# EAGLE design 20-pin (EAGLE 9.6.2)
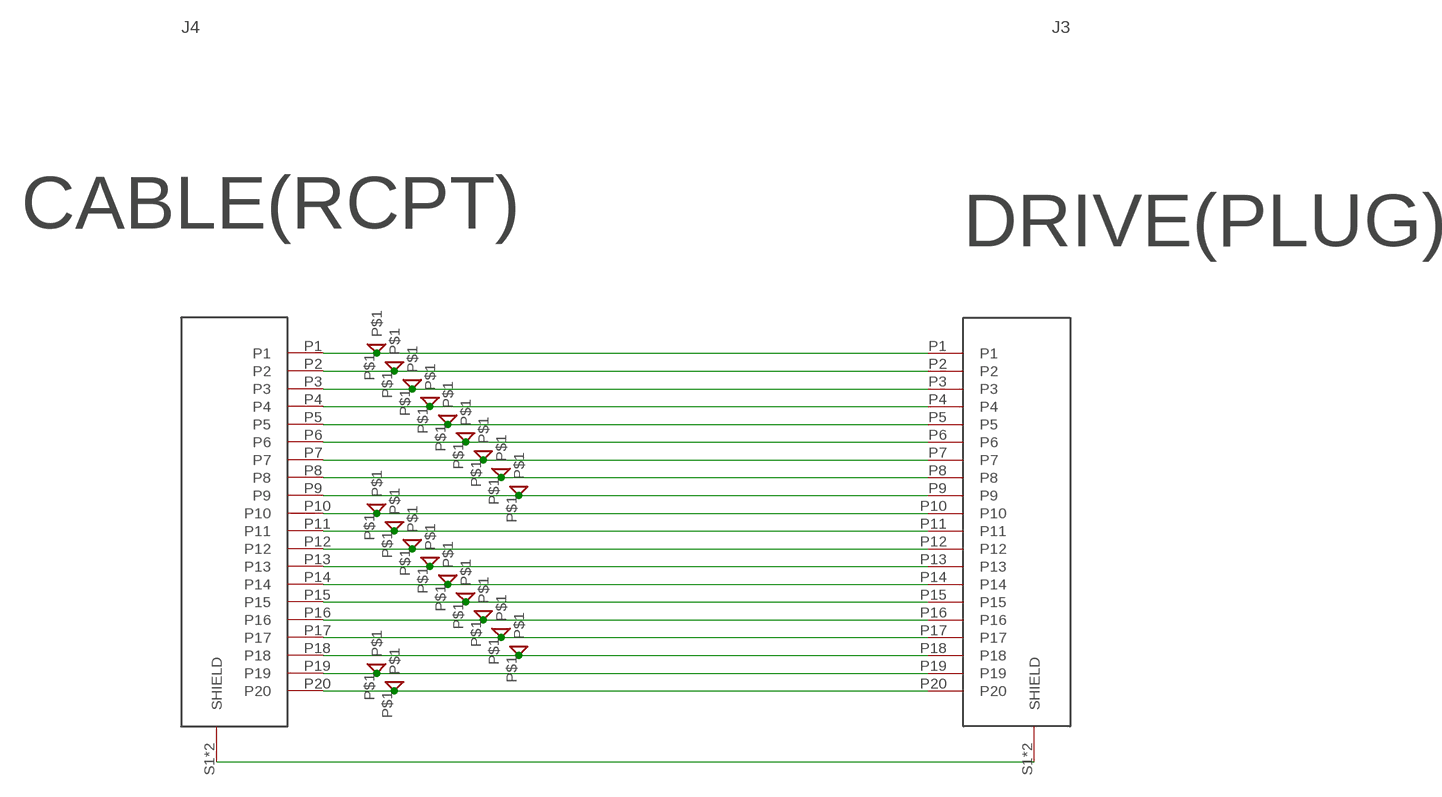
[diagram p0: schematic, sheet 1]

## Parts
J3  3M_10120-52E2PC(PLUG)  [3M_10120-52E2PC(PLUG)]
J4  3M_10220-55H3PC(RECEPTACLE)  [3M_10220-55H3PC(RECEPTACLE)]
U$1  PTH_SMALL  [PTH_SMALL]
U$2  PTH_SMALL  [PTH_SMALL]
U$3  PTH_SMALL  [PTH_SMALL]
U$4  PTH_SMALL  [PTH_SMALL]
U$5  PTH_SMALL  [PTH_SMALL]
U$6  PTH_SMALL  [PTH_SMALL]
U$7  PTH_SMALL  [PTH_SMALL]
U$8  PTH_SMALL  [PTH_SMALL]
U$9  PTH_SMALL  [PTH_SMALL]
U$10  PTH_SMALL  [PTH_SMALL]
U$11  PTH_SMALL  [PTH_SMALL]
U$12  PTH_SMALL  [PTH_SMALL]
U$13  PTH_SMALL  [PTH_SMALL]
U$14  PTH_SMALL  [PTH_SMALL]
U$15  PTH_SMALL  [PTH_SMALL]
U$16  PTH_SMALL  [PTH_SMALL]
U$17  PTH_SMALL  [PTH_SMALL]
U$18  PTH_SMALL  [PTH_SMALL]
U$19  PTH_SMALL  [PTH_SMALL]
U$20  PTH_SMALL  [PTH_SMALL]

## Nets
N$1: J3.P1 J4.P1 U$1.P$1
N$2: J3.P2 J4.P2 U$2.P$1
N$3: J3.P3 J4.P3 U$3.P$1
N$4: J3.P4 J4.P4 U$4.P$1
N$5: J3.P5 J4.P5 U$5.P$1
N$6: J3.P6 J4.P6 U$6.P$1
N$7: J3.P7 J4.P7 U$7.P$1
N$8: J3.P8 J4.P8 U$8.P$1
N$9: J3.P9 J4.P9 U$9.P$1
N$10: J3.P10 J4.P10 U$10.P$1
N$11: J3.P11 J4.P11 U$11.P$1
N$12: J3.P12 J4.P12 U$12.P$1
N$13: J3.P13 J4.P13 U$13.P$1
N$14: J3.P14 J4.P14 U$14.P$1
N$15: J3.P15 J4.P15 U$15.P$1
N$16: J3.P16 J4.P16 U$16.P$1
N$17: J3.P17 J4.P17 U$17.P$1
N$18: J3.P18 J4.P18 U$18.P$1
N$19: J3.P19 J4.P19 U$19.P$1
N$20: J3.P20 J4.P20 U$20.P$1
SHIELD: J3.S1(SHIELD) J3.S2(SHIELD) J4.S1(SHIELD) J4.S2(SHIELD)

## Notes on the sheet
- CABLE(RCPT) | DRIVE(PLUG)

## Library data of the parts
J3 = mini-d-sub:3M_10120-52E2PC(PLUG)
J4 = mini-d-sub:3M_10220-55H3PC(RECEPTACLE)
U$1-U$20 = testpoint:PTH_SMALL

## Board
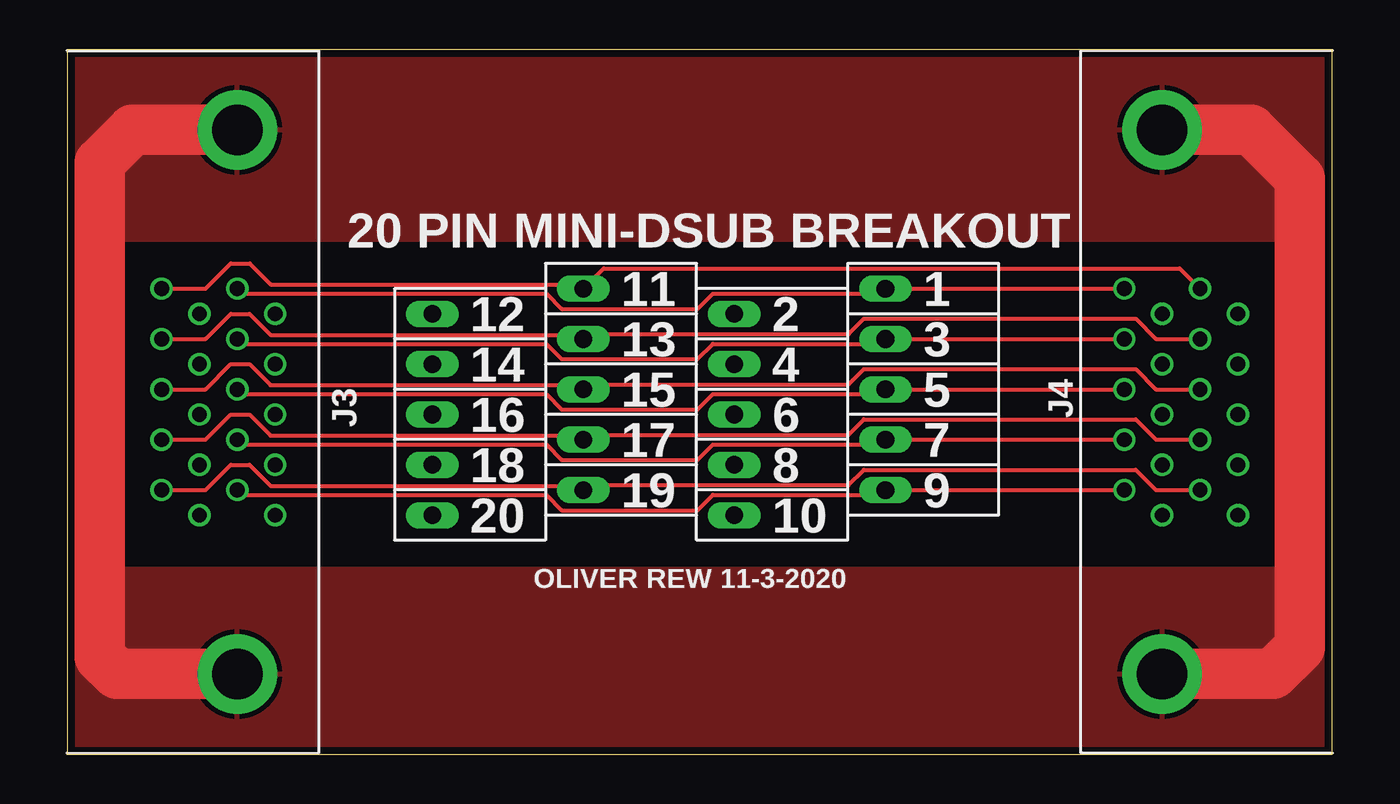
[diagram p1: board, top side]
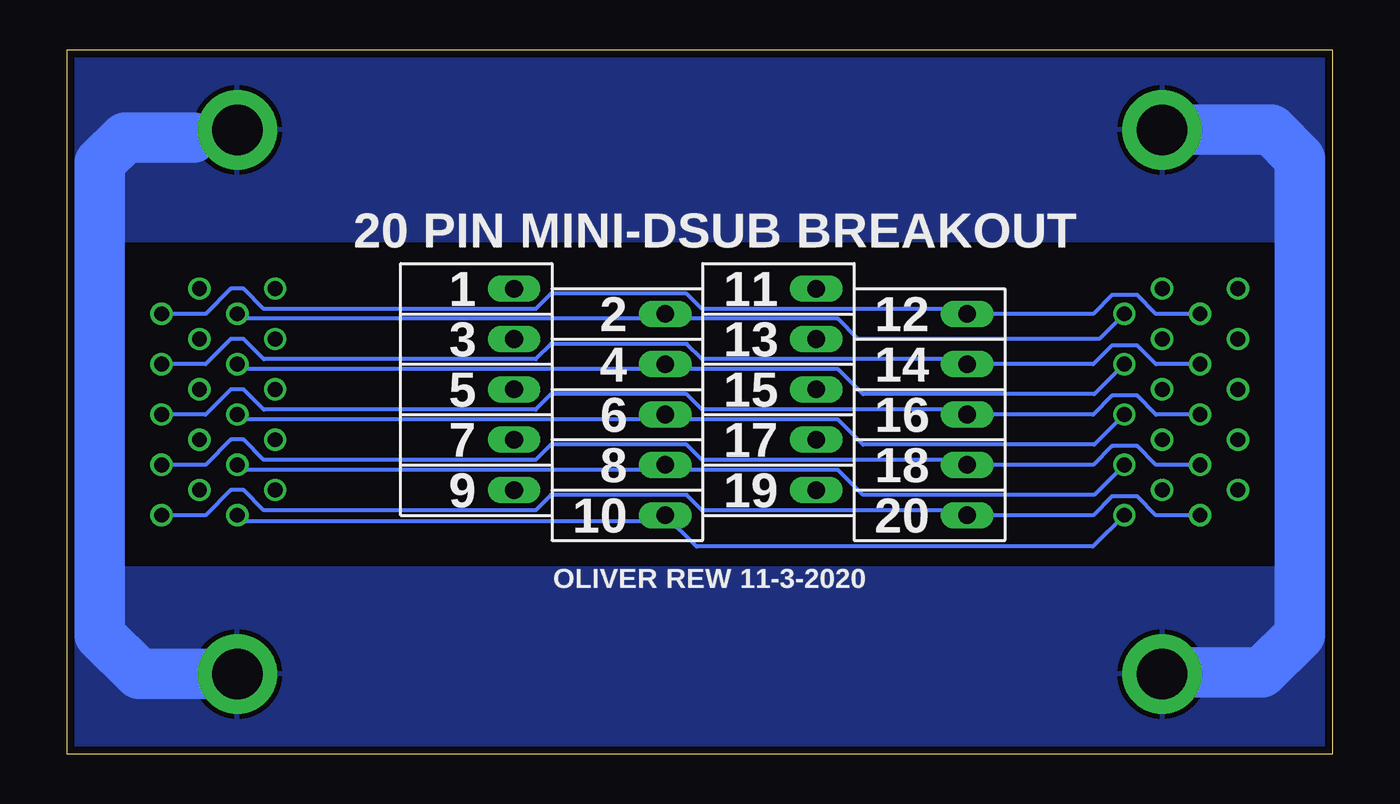
[diagram p2: board, bottom side, seen from below]

Size 63.82 x 35.56 mm. Coordinates in mm from the lower left corner, seen from the top.
Outline: 63.82,35.56 0,35.56 0,0 63.82,0 63.82,35.56
Copper layers (1*16): Top 0.035559375mm / dielectric 1.6mm / Bottom 0.035559375mm
Design rules "oshpark-2layer *": minimum track width 6mil, minimum drill 10mil, track to track 10mil, track to pad 10mil, pad to pad 10mil, via to via 10mil, smd to smd 6mil, copper to edge 15mil, drill to drill 6mil, minimum pad ring 5mil, minimum via ring 5mil, stop-mask expansion 2.5mil, vias tented up to drill 0mil, thermal gap 10mil

### Footprints (pad centres in the part's own frame; a part is rotated, then mirrored left to right if it is on the bottom)
3M_10120-52E2PC(PLUG) = drill 0.75: P1 -5.715,3.82; P2 -4.445,5.73; P3 -3.175,3.82; P4 -1.905,5.73; P5 -0.635,3.82; P6 0.635,5.73; P7 1.905,3.82; P8 3.175,5.73; P9 4.445,3.82; P10 5.715,5.73; P11 -5.715,0; P12 -4.445,1.91; P13 -3.175,0; P14 -1.905,1.91; P15 -0.635,0; P16 0.635,1.91; P17 1.905,0; P18 3.175,1.91; P19 4.445,0; P20 5.715,1.91 | drill 2.54 pad 4: S1 -13.725,3.82; S2 13.725,3.82
3M_10220-55H3PC(RECEPTACLE) = drill 0.75: P1 5.715,5.73; P2 4.445,3.82; P3 3.175,5.73; P4 1.905,3.82; P5 0.635,5.73; P6 -0.635,3.82; P7 -1.905,5.73; P8 -3.175,3.82; P9 -4.445,5.73; P10 -5.715,3.82; P11 5.715,1.91; P12 4.445,0; P13 3.175,1.91; P14 1.905,0; P15 0.635,1.91; P16 -0.635,0; P17 -1.905,1.91; P18 -3.175,0; P19 -4.445,1.91; P20 -5.715,0 | drill 2.54 pad 4: S1 -13.725,3.82; S2 13.725,3.82
PTH_SMALL = drill 0.889 long: P$1 0,0

### Placement (x,y rotation side)
J3  4.76,17.78 270 top
J4  59.05,17.78 90 top
U$1  41.27,23.5 180 top
U$2  33.66,22.23 180 top
U$3  41.27,20.95 180 top
U$4  33.66,19.68 180 top
U$5  41.27,18.41 180 top
U$6  33.66,17.14 180 top
U$7  41.27,15.88 180 top
U$8  33.66,14.61 180 top
U$9  41.27,13.34 180 top
U$10  33.66,12.06 180 top
U$11  26.04,23.5 180 top
U$12  18.41,22.23 180 top
U$13  26.04,20.95 180 top
U$14  18.41,19.68 180 top
U$15  26.04,18.41 180 top
U$16  18.41,17.14 180 top
U$17  26.04,15.88 180 top
U$18  18.41,14.61 180 top
U$19  26.04,13.34 180 top
U$20  18.41,12.06 180 top

### Tracks (layer width: path | path; a pad name or v marks a point on that pad's centre or on a via)
N$1
  Top 0.203: J3.P1 8.83,23.25 24.17,23.25 24.95,22.47 31.79,22.47 32.56,23.25 41.03,23.25 U$1.P$1 J4.P1
N$2
  Bottom 0.203: J3.P2 11.76,20.95 23.92,20.95 24.95,21.98 33.41,21.98 U$2.P$1 33.9,21.98 54.99,21.98 J4.P2
N$3
  Top 0.203: J3.P3 8.83,20.71 24.17,20.71 24.95,19.93 31.79,19.93 32.56,20.71 41.03,20.71 U$3.P$1 J4.P3
N$4
  Bottom 0.203: J3.P4 12.01,18.17 23.68,18.17 24.95,19.44 33.41,19.44 U$4.P$1 33.9,19.44 54.99,19.44 J4.P4
N$5
  Top 0.203: J3.P5 8.83,18.17 24.17,18.17 24.95,17.39 31.79,17.39 32.56,18.17 41.03,18.17 U$5.P$1 J4.P5
N$6
  Bottom 0.203: J3.P6 12.01,15.63 23.68,15.63 24.95,16.9 33.41,16.9 U$6.P$1 33.9,16.9 54.99,16.9 J4.P6
N$7
  Top 0.203: J3.P7 8.83,15.63 24.17,15.63 24.95,14.85 31.79,14.85 32.56,15.63 41.03,15.63 U$7.P$1 J4.P7
N$8
  Bottom 0.203: J3.P8 12.01,13.09 23.68,13.09 24.95,14.36 33.41,14.36 U$8.P$1 33.9,14.36 54.99,14.36 J4.P8
N$9
  Top 0.203: J3.P9 8.83,13.09 24.17,13.09 24.95,12.31 31.79,12.31 32.56,13.09 41.03,13.09 U$9.P$1 J4.P9
N$10
  Bottom 0.203: J3.P10 12.08,10.48 32.07,10.48 U$10.P$1 33.97,11.75 54.92,11.75 J4.P10
N$11
  Top 0.203: J3.P11 6.99,23.5 8.26,24.77 9.21,24.77 10.27,23.7 25.82,23.7 U$11.P$1 27.06,24.52 56.12,24.52 J4.P11
N$12
  Bottom 0.203: J3.P12 8.89,22.23 9.84,23.18 11.11,23.18 12.06,22.23 U$12.P$1 18.66,22.47 31.79,22.47 32.56,23.25 39.41,23.25 40.19,22.47 53.91,22.47 54.93,23.5 55.56,23.5 56.83,22.23 J4.P12
N$13
  Top 0.203: J3.P13 6.99,20.95 8.26,22.23 9.19,22.23 10.26,21.16 25.82,21.16 U$13.P$1 26.28,21.2 39.41,21.2 40.19,21.98 53.91,21.98 54.93,20.95 J4.P13
N$14
  Bottom 0.203: J3.P14 8.89,19.68 9.84,20.64 11.11,20.64 12.06,19.68 U$14.P$1 18.66,19.93 31.79,19.93 32.56,20.71 39.41,20.71 40.19,19.93 53.91,19.93 54.93,20.95 55.56,20.95 56.83,19.68 J4.P14
N$15
  Top 0.203: J3.P15 6.99,18.41 8.26,19.68 9.19,19.68 10.26,18.62 25.82,18.62 U$15.P$1 26.28,18.66 39.41,18.66 40.19,19.44 53.91,19.44 54.93,18.41 J4.P15
N$16
  Bottom 0.203: J3.P16 8.89,17.14 9.84,18.1 11.11,18.1 12.06,17.14 U$16.P$1 18.66,17.39 31.79,17.39 32.56,18.17 39.41,18.17 40.19,17.39 53.91,17.39 54.93,18.41 55.56,18.41 56.83,17.14 J4.P16
N$17
  Top 0.203: J3.P17 6.99,15.88 8.26,17.14 9.19,17.14 10.26,16.09 25.82,16.09 U$17.P$1 26.28,16.12 39.41,16.12 40.19,16.9 53.91,16.9 54.93,15.88 J4.P17
N$18
  Bottom 0.203: J3.P18 8.89,14.61 9.84,15.56 11.11,15.56 12.06,14.61 U$18.P$1 18.66,14.85 31.79,14.85 32.56,15.63 39.41,15.63 40.19,14.85 51.44,14.85 53.91,14.85 54.93,15.88 55.56,15.88 56.83,14.61 J4.P18
N$19
  Top 0.203: J3.P19 6.99,13.34 8.26,14.61 9.19,14.61 10.26,13.54 25.82,13.54 U$19.P$1 26.28,13.58 39.41,13.58 40.19,14.36 53.91,14.36 54.93,13.34 J4.P19
N$20
  Bottom 0.203: J3.P20 8.89,12.06 9.84,13.02 11.11,13.02 12.06,12.06 U$20.P$1 18.66,12.31 31.79,12.31 32.56,13.09 39.41,13.09 40.19,12.31 53.91,12.31 54.93,13.34 55.56,13.34 56.83,12.06 J4.P20
SHIELD
  Top 2.54: J3.S2 2.52,4.05 1.65,4.92 1.65,29.84 3.31,31.5 J3.S1 | J4.S1 60.82,4.05 62.17,5.4 62.17,29.05 59.71,31.5 J4.S2
  Bottom 2.54: J3.S1 3.09,31.5 1.65,30.07 1.65,6.03 3.56,4.13 8.51,4.13 J3.S2 | J4.S1 60.19,4.05 62.17,6.03 62.17,29.84 60.9,31.11 57.47,31.11
  pour Top: -1.25,9.38 65,9.38 65,-1.25 -1.25,-1.25
  pour Top: -1.25,36.58 65,36.58 65,25.95 -1.25,25.95
  pour Bottom: -1.25,36.58 65,36.58 65,25.95 -1.25,25.95
  pour Bottom: -1.25,9.38 65,9.38 65,-1.25 -1.25,-1.25

### Text on the board
tPlace: 20 PIN MINI-DSUB BREAKOUT | 11 | 1 | 12 | 2 | 13 | 3 | 14 | 4 | 15 | 5 | 16 | 6 | 17 | 7 | 18 | 8 | 19 | 9 | 20 | 10 | OLIVER REW 11-3-2020
bPlace: 20 PIN MINI-DSUB BREAKOUT | 11 | 1 | 12 | 2 | 13 | 3 | 14 | 4 | 15 | 5 | 16 | 6 | 17 | 7 | 18 | 8 | 19 | 9 | 20 | 10 | OLIVER REW 11-3-2020
Document: DRIVE(PLUG) | CABLE(RECEPTACLE)